# Altium schematic sheet GPIO_Pullups_Pulldowns.SchDoc
size A4; DocumentNumber: 6; SheetNumber: 7; SheetTotal: 7
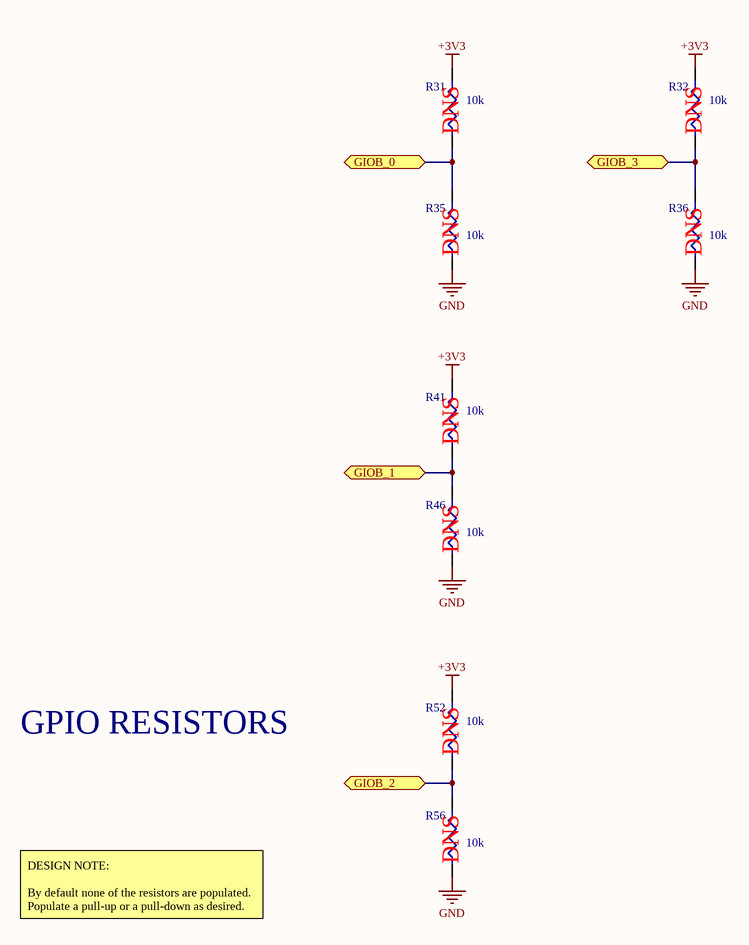
[diagram p0: GPIO_Pullups_Pulldowns.SchDoc]

## Parts
R31  10k  [R0805]
R32  10k  [R0805]
R35  10k  [R0805]
R36  10k  [R0805]
R41  10k  [R0805]
R46  10k  [R0805]
R52  10k  [R0805]
R56  10k  [R0805]

## Ports
GIOB_0, GIOB_1, GIOB_2, GIOB_3

## Nets
+3V3: R31.2 R32.2 R41.2 R52.2
GND: R35.1 R36.1 R46.1 R56.1
GIOB_0: R31.1 R35.2 ; port GIOB_0
GIOB_1: R41.1 R46.2 ; port GIOB_1
GIOB_2: R52.1 R56.2 ; port GIOB_2
GIOB_3: R32.1 R36.2 ; port GIOB_3

## Notes on the sheet
- (near R31) DNS
- (near R32) DNS
- (near R35) DNS
- (near R36) DNS
- (near R41) DNS
- (near R46) DNS
- GPIO RESISTORS
- (near R52) DNS
- DESIGN NOTE:
  By default none of the resistors are populated. Populate a pull-up or a pull-down as desired.
- (near R56) DNS

## Library data of the parts
R31 R32 R35 R36 R41 R46 R52 R56 = RC0805FR-071KL: RES SMD 10K OHM 1% 1/8W 0805; Manufacturer: Yageo Phycomp; Temperature Coefficient: 100ppm/°C; Resistance: 1KR; Voltage Rating (DC): 150V; Power Rating: 125mW; Supplier 1: Digi-Key; Manufacturer Part Number: RC0805FR-071KL; Stock 1: 5527973; Pricing 1: 1=0.1, 10=0.022, 100=0.0088, 1000=0.004, 2500=0.0034 (USD); Case/Package: 0805; Number of Pins: 2; Min Operating Temperature: -55°C; Max Operating Temperature: 155°C; Tolerance: 1%; Packaging: Cut Tape; Length: 2mm; Height: 0.5mm; Width: 1.25mm; Depth: 1.25mm; REACH SVHC: No SVHC; Lead Free: Lead Free